# Altium schematic sheet HDMI.SchDoc
size A4; SheetNumber: 10; SheetTotal: 16
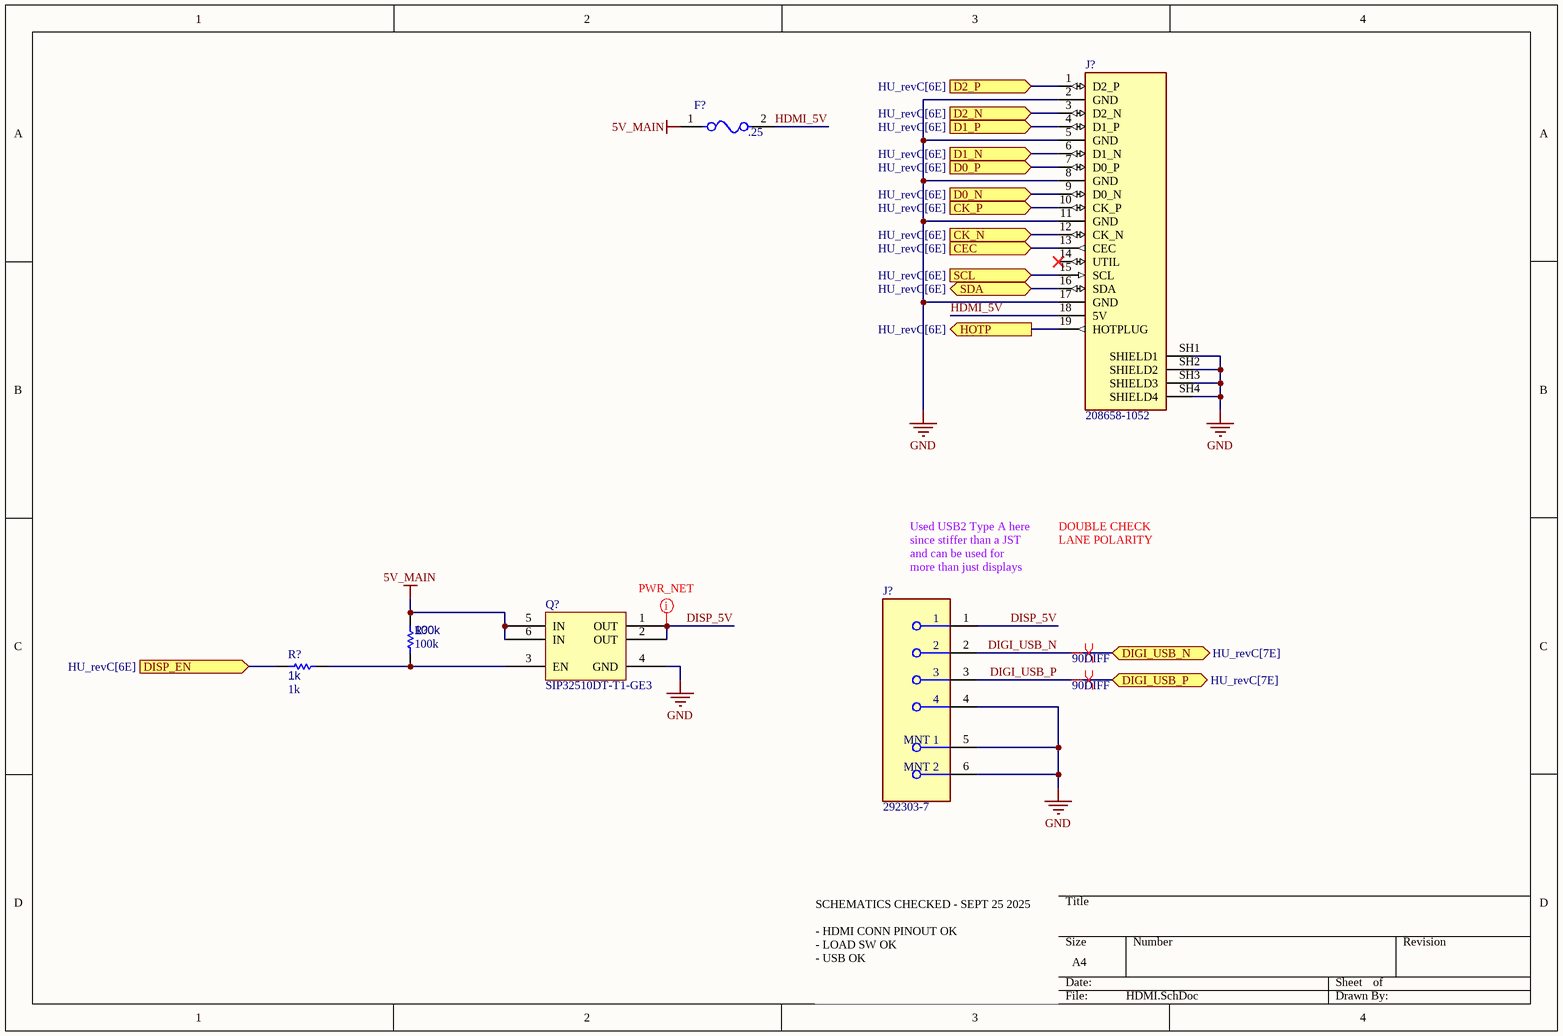
[diagram p0: HDMI.SchDoc]

## Parts
(Parts that share a designator on the sheet are numbered #1, #2 ... from top to bottom, then left to right.)
F?  .25  [FP-0685T-MFG]
J?#1  208658-1052  [208658-1052-Footprint-1]
J?#2  292303-7  [FP-292303-7-MFG]
Q?  SIP32510DT-T1-GE3  [SOT95P284X110-6N]
R?#1  100k  [R0603B]
R?#2  1k  [R0603B]

## Ports
CEC (in, see HU_revC[6E]), CK_N (in, see HU_revC[6E]), CK_P (in, see HU_revC[6E]), D0_N (in, see HU_revC[6E]), D0_P (in, see HU_revC[6E]), D1_N (in, see HU_revC[6E]), D1_P (in, see HU_revC[6E]), D2_N (in, see HU_revC[6E]), D2_P (in, see HU_revC[6E]), DIGI_USB_N (bidir, see HU_revC[7E]), DIGI_USB_P (bidir, see HU_revC[7E]), DISP_EN (in, see HU_revC[6E]), HOTP (out, see HU_revC[6E]), SCL (in, see HU_revC[6E]), SDA (bidir, see HU_revC[6E])

## Nets
5V_MAIN: F?.1 Q?.5(IN) Q?.6(IN) R?#1.2
GND: J?#1.2(GND) J?#1.5(GND) J?#1.8(GND) J?#1.11(GND) J?#1.17(GND) J?#1.SH1(SHIELD1) J?#1.SH2(SHIELD2) J?#1.SH3(SHIELD3) J?#1.SH4(SHIELD4) J?#2.4 J?#2.5(MNT_1) J?#2.6(MNT_2) Q?.4(GND)
CEC: J?#1.13(CEC) ; port CEC
CK_N: J?#1.12(CK_N) ; port CK_N
CK_P: J?#1.10(CK_P) ; port CK_P
D0_N: J?#1.9(D0_N) ; port D0_N
D0_P: J?#1.7(D0_P) ; port D0_P
D1_N: J?#1.6(D1_N) ; port D1_N
D1_P: J?#1.4(D1_P) ; port D1_P
D2_N: J?#1.3(D2_N) ; port D2_N
D2_P: J?#1.1(D2_P) ; port D2_P
DIGI_USB_N: J?#2.2 ; port DIGI_USB_N
DIGI_USB_P: J?#2.3 ; port DIGI_USB_P
DISP_5V: J?#2.1 Q?.1(OUT) Q?.2(OUT)
DISP_EN: R?#2.2 ; port DISP_EN
HDMI_5V: F?.2 J?#1.18(5V)
HOTP: J?#1.19(HOTPLUG) ; port HOTP
SCL: J?#1.15(SCL) ; port SCL
SDA: J?#1.16(SDA) ; port SDA
NetQ?_3: Q?.3(EN) R?#1.1 R?#2.1

Not connected (* = marked no-connect by the designer): J?#1 14(UTIL)*

## Layout directives
differential pair; differential pair class 90DIFF: DIGI_USB_N, DIGI_USB_P
net class PWR: DISP_5V

## Notes on the sheet
- Used USB2 Type A here since stiffer than a JST and can be used for more than just displays
- DOUBLE CHECK LANE POLARITY
- SCHEMATICS CHECKED - SEPT 25 2025
  - HDMI CONN PINOUT OK
  - LOAD SW OK
  - USB OK

## Library data of the parts
F? = CMP-16042-000006-1: FUSE BOARD MNT 5A 63VAC/VDC 1206; RoHS Compliant: Yes
J?#1 = CMP-002-00089-3: HDMI CONNECTOR, RCPT, 19POS, SMT; Available until stocks are exhausted Alternative available; Gender: Female; Min Operating Temperature: -20°C; Max Operating Temperature: 85°C; Pins: 19
J?#2 = CMP-03360-000008-1: CONN RCPT USB2.0 TYPEA 4P SMD RA; Manufacturer: TE Connectivity; Is Female: yes; Current Rating: 1A; Number Of Contacts: 4; Voltage Rating: 30V; Conn Orientation: Right Angle; Shielding: true; Digikey Description: CONN RCPT USB2.0 TYPEA 4P SMD RA; Manufacturer Part Number: 292303-7; Automotive: No; Category: Conn; Temperature: -55°C to +85°C; ComponentLink2Description: Datasheet; Mouser Description: USB Connectors USB A R/A Recpt Assy SMT; Contact Material: Gold,Nickel; Package: 292303-7; Device Class L3: unset; Octopart: https://octopart.com/292303-7-te+connectivity-42840369; RoHS: TRUE; Device Class L2: USB Connectors; ComponentLink2URL: https://www.te.com/usa-en/product-292303-7.html?te_bu=Cor&te_type=other&te_campaign=oct_glo_cor-oct-global-oth-prtnr-fy19-oct-octo-buy-bom_sma-298_2&elqCampaignId=35216; Temperature Range Low: -55°C; Usb Standard: USB 2.0; Temperature Range High: +85°C; Lead Free: Yes; Device Class L1: Connectors
Q? = CMP-019-00054-1: Power Switch ICs – Power Distribution; VISHAY; SIP32510DT-T1-GE3; 1; 1; 5.5 V; SOT-23-6; Max Supply Voltage: 5.5V; Max Power Dissipation: 833mW; Min Supply Voltage: 1.2V; Case/Package: SOT-23-6; Mounting Technology: Surface Mount; Max Operating Temperature: 85°C; Min Operating Temperature: -40°C
R?#1 R?#2 = CMP-009-00002-14: Resistor
  R?#1: Value: 100k
  R?#2: Value: 1k